# EAGLE schematic ATtiny85 and DRV8830 Combo -- v03 (EAGLE 6.5.0)
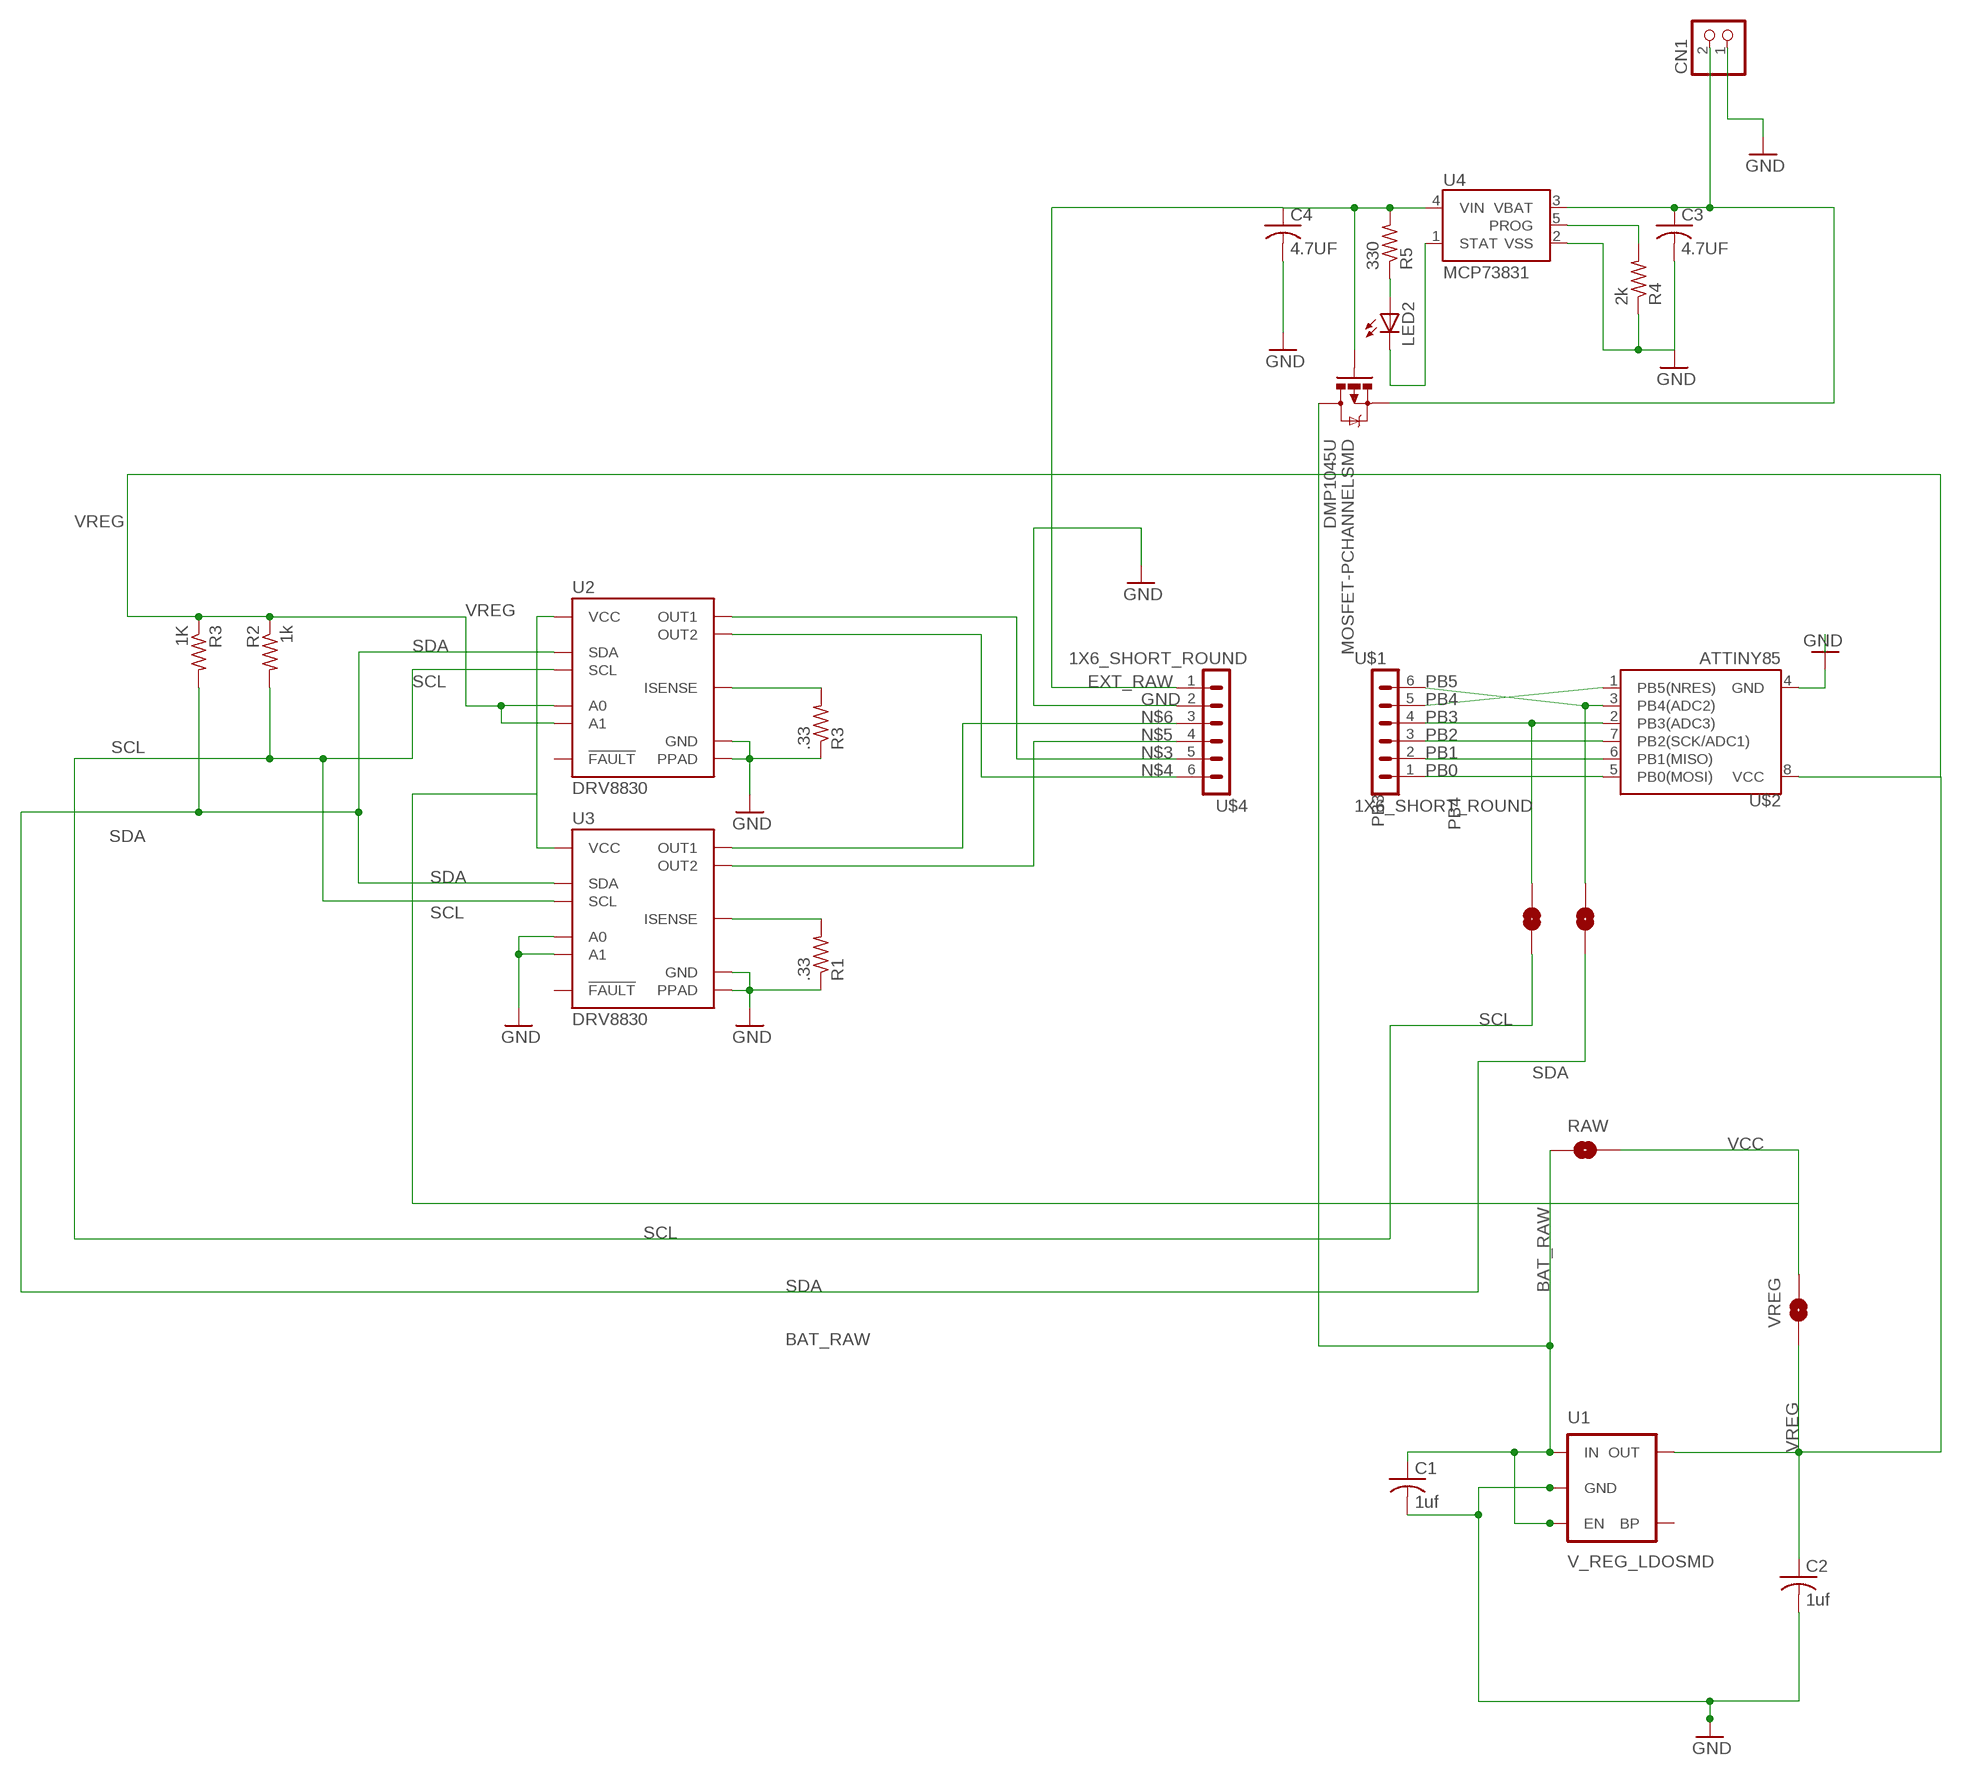
[diagram p0: schematic, sheet 1]

## Parts
1K  R3  R-US_R0402  [R0402]
C1  1uf  C-USC0402  [C0402]
C2  1uf  C-USC0402  [C0402]
C3  4.7UF  C-USC0805K  [C0805K]
C4  4.7UF  C-USC0805K  [C0805K]
CN1  JST_2PIN-THM  [JST-PH-2-THM]
DMP1045U  MOSFET-PCHANNELSMD  [SOT23-3]
LED2  LEDSML0603  [SML0603]
R1  .33  R-US_R0402  [R0402]
R2  1k  R-US_R0402  [R0402]
R3  .33  R-US_R0402  [R0402]
R4  2k  R-US_R0402  [R0402]
R5  330  R-US_R0402  [R0402]
RAW  SOLDERJUMPERNO  [SJ_2S-NO]
SJ6  SOLDERJUMPERNO  [SJ_2S-NO]
SJ7  SOLDERJUMPERNO  [SJ_2S-NO]
U1  V_REG_LDOSMD  [SOT23-5]
U2  DRV8830  [MSOP-10-GNDPAD]
U3  DRV8830  [MSOP-10-GNDPAD]
U4  MCP73831  [SOT23-5]
U$1  1X6_SHORT_ROUND  [1X6_SHORT_ROUND]
U$2  ATTINY85  ATTINY45  [SO08-EIAJ]
U$4  1X6_SHORT_ROUND  [1X6_SHORT_ROUND]
VREG  SOLDERJUMPERNO  [SJ_2S-NO]

## Nets
BAT_RAW: C1.1 DMP1045U.3(D) RAW.1 U1.1(IN) U1.3(EN)
EXT_RAW: C4.1 DMP1045U.1(G) R5.2 U4.4(VIN) U$4.1
GND: C1.2 C2.2 C3.2 C4.2 CN1.1 R1.1 R3.1 R4.1 U1.2(GND) U2.5(GND) U2.GND(PPAD) U3.5(GND) U3.7(A0) U3.8(A1) U3.GND(PPAD) U4.2(VSS) U$2.4(GND) U$4.2
N$1: R1.2 U3.2(ISENSE)
N$2: R3.2 U2.2(ISENSE)
N$3: U2.3(OUT1) U$4.5
N$4: U2.1(OUT2) U$4.6
N$5: U3.1(OUT2) U$4.4
N$6: U3.3(OUT1) U$4.3
N$7: LED2.A R5.1
N$8: C3.1 CN1.2 DMP1045U.2(S) U4.3(VBAT)
N$9: R4.2 U4.5(PROG)
N$10: LED2.C U4.1(STAT)
PB0: U$1.1 U$2.5(PB0(MOSI))
PB1: U$1.2 U$2.6(PB1(MISO))
PB2: U$1.3 U$2.7(PB2(SCK/ADC1))
PB3: SJ7.2 U$1.4 U$2.2(PB3(ADC3))
PB4: SJ6.2 U$1.6 U$2.3(PB4(ADC2))
PB5: U$1.5 U$2.1(PB5(NRES))
SCL: R2.2 SJ7.1 U2.10(SCL) U3.10(SCL)
SDA: 1K.2 SJ6.1 U2.9(SDA) U3.9(SDA)
VCC: RAW.2 U2.4(VCC) U3.4(VCC) VREG.2
VREG: 1K.1 C2.1 R2.1 U1.5(OUT) U2.7(A0) U2.8(A1) U$2.8(VCC) VREG.1
Unconnected: U1.4(BP) U2.6(!FAULT) U3.6(!FAULT)

## Library data of the parts
1K R1-R5 = resistor:R-US_: RESISTOR, American symbol
C1-C4 = resistor:C-US: CAPACITOR, American symbol
CN1 = adafruit:JST_2PIN: JST 2-Pin Connectors of various flavors SMT-RA (S2B-PH-SM4) 4UConnector #17311 SMT (B2B-PH-SM4) THM-RA (S2B-PH) THM (B2B-PH)
DMP1045U = SparkFun-DiscreteSemi:MOSFET-PCHANNEL: Generic PMOSFET
LED2 = led:LED: LED OSRAM: - CHIPLED LG R971, LG N971, LY N971, LG Q971, LY Q971, LO R971, LY R971 LH N974, LH R974 LS Q976, LO Q976, LY Q976 LO Q996 - Hyper CHIPLED LW Q18S LB Q993, LB Q99A, LB R99A - SideLED LS A670, LO A670, LY A670, LG A670, LP A670 LB A673, LV A673, LT A673, LW A673 LH A674 LY A675 LS A676, LA A676, LO A676, LY A676, LW A676 LS A679, LY A679, LG A679 - Hyper Micro SIDELED® LS Y876, LA Y876, LO Y876, LY Y876 LT Y87S - SmartLED LW L88C, LW L88S LB L89C, LB L89S, LG L890 LS L89K, LO L89K, LY L89K LS L896, LA L896, LO L896, LY L896 - TOPLED LS T670, LO T670, LY T670, LG T670, LP T670 LSG T670, LSP T670, LSY T670, LOP T670, LYG T670 LG T671, LOG T671, LSG T671 LB T673, LV T673, LT T673, LW T673 LH T674 LS T676, LA T676, LO T676, LY T676, LB T676, LH T676, LSB T676, LW T676 LB T67C, LV T67C, LT T67C, LS T67K, LO T67K, LY T67K, LW E67C LS E67B, LA E67B, LO E67B, LY E67B, LB E67C, LV E67C, LT E67C LW T67C LS T679, LY T679, LG T679 LS T770, LO T770, LY T770, LG T770, LP T770 LB T773, LV T773, LT T773, LW T773 LH T774 LS E675, LA E675, LY E675, LS T675 LS T776, LA T776, LO T776, LY T776, LB T776 LHGB T686 LT T68C, LB T68C - Hyper Mini TOPLED® LB M676 - Mini TOPLED Santana® LG M470 LS M47K, LO M47K, LY M47K Source: http://www.osram.convergy.de LUXEON: - LUMILED® LXK2-PW12-R00, LXK2-PW12-S00, LXK2-PW14-U00, LXK2-PW14-V00 LXK2-PM12-R00, LXK2-PM12-S00, LXK2-PM14-U00 LXK2-PE12-Q00, LXK2-PE12-R00, LXK2-PE12-S00, LXK2-PE14-T00, LXK2-PE14-U00 LXK2-PB12-K00, LXK2-PB12-L00, LXK2-PB12-M00, LXK2-PB14-N00, LXK2-PB14-P00, LXK2-PB14-Q00 LXK2-PR12-L00, LXK2-PR12-M00, LXK2-PR14-Q00, LXK2-PR14-R00 LXK2-PD12-Q00, LXK2-PD12-R00, LXK2-PD12-S00 LXK2-PH12-R00, LXK2-PH12-S00 LXK2-PL12-P00, LXK2-PL12-Q00, LXK2-PL12-R00 Source: www.luxeon.com KINGBRIGHT: KA-3528ASYC Source: www.kingbright.com
RAW SJ6 SJ7 VREG = SparkFun:SOLDERJUMPER: Solder Jumper Standard SMD solder jumper. Used to automate production. Two varients : Normally Open and Normally Closed are the same, but have different paste layers. NC will have a large amount of paste and should jumper during reflow.
U1 = SparkFun:V_REG_LDO: Voltage Regulator LDO Standard 150mA LDO voltage regulator in SOT-23 layout. Micrel part MIC5205. BP (by-pass) pin is used to lower output noise with 470pF cap.
U2 U3 = SparkFun-PowerIC:DRV8830: DRV8830 I2C DC Motor Driver TSSOP-10 with exposed power pad 1A current limit, 2.75V to 6.8V; PROD_ID: IC-11646
U4 = SparkFun-PowerIC:MCP73831: Miniature single cell, fully integrated Li-Ion, Li-polymer charge management controller http://ww1.microchip.com/downloads/en/DeviceDoc/21984a.pdf IC-09995; PROD_ID: IC-09995
U$1 U$4 = Random parts(01-14-14):1X6_SHORT_ROUND
U$2 = SparkFun:ATTINY45: Atmel ATTiny45